# EAGLE design B7 OpenCR PCB Shield (EAGLE 9.6.2)
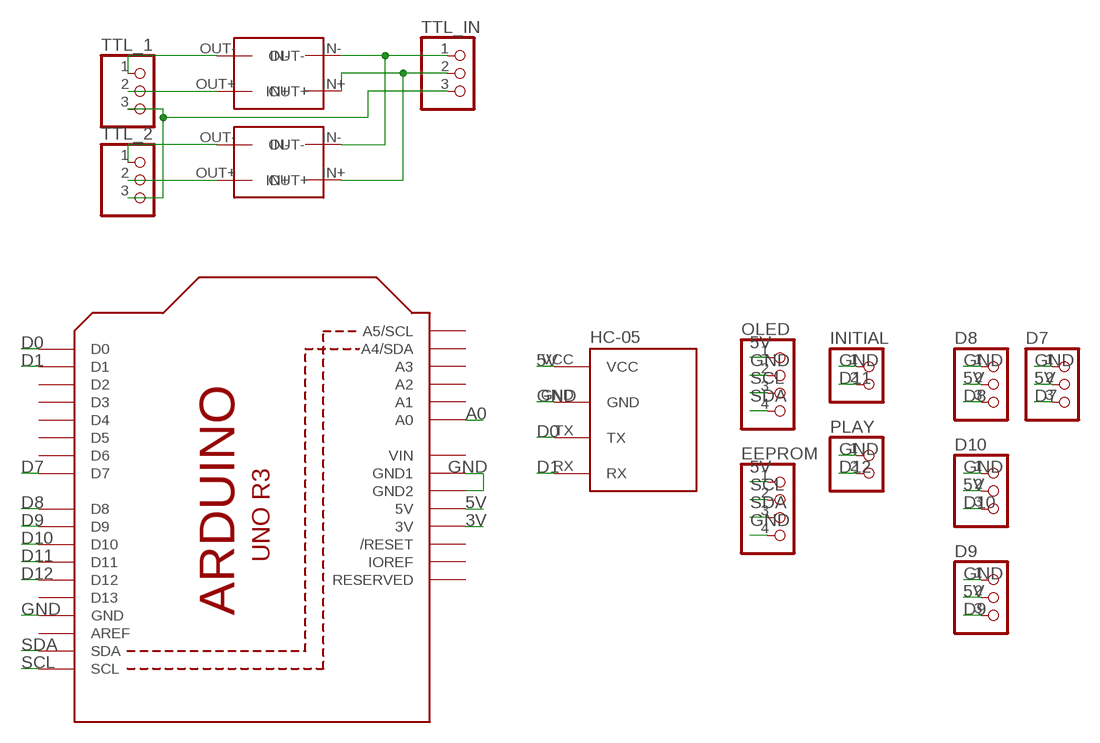
[diagram p0: schematic, sheet 1]

## Parts
D7  PINHD-1X3  [1X03]
D8  PINHD-1X3  [1X03]
D9  PINHD-1X3  [1X03]
D10  PINHD-1X3  [1X03]
EEPROM  PINHD-1X4  [1X04]
HC-05  BLUETOOTH_BOARD  [BT_BOARD_FOOTPRINT]
INITIAL  PINHD-1X2  [1X02]
OLED  PINHD-1X4  [1X04]
PLAY  PINHD-1X2  [1X02]
TTL_1  PINHD-1X3  [1X03]
TTL_2  PINHD-1X3  [1X03]
TTL_IN  PINHD-1X3  [1X03]
U2  ARDUINOR3-BPLACE  [ARDUINOR3-BPLACE]
U$1  LM2596LM2596  [LM2596]
U$2  LM2596LM2596  [LM2596]

## Nets
3V: U2.3V
5V: D7.2 D8.2 D9.2 D10.2 EEPROM.1 HC-05.VCC OLED.1 U2.5V
A0: U2.A0
D0: HC-05.TX U2.D0
D1: HC-05.RX U2.D1
D7: D7.3 U2.D7
D8: D8.3 U2.D8
D9: D9.3 U2.D9
D10: D10.3 U2.D10
D11: INITIAL.2 U2.D11
D12: PLAY.2 U2.D12
GND: D7.1 D8.1 D9.1 D10.1 EEPROM.4 HC-05.GND INITIAL.1 OLED.2 PLAY.1 U2.GND U2.GND1 U2.GND2
N$1: TTL_IN.1 U$1.IN- U$2.IN-
N$2: TTL_IN.2 U$1.IN+ U$2.IN+
N$3: TTL_1.3 TTL_2.3 TTL_IN.3
N$4: TTL_1.2 U$1.OUT+
N$5: TTL_2.2 U$2.OUT+
N$6: TTL_1.1 U$1.OUT-
N$9: TTL_2.1 U$2.OUT-
SCL: EEPROM.2 OLED.3 U2.SCL
SDA: EEPROM.3 OLED.4 U2.SDA
Unconnected: U2.A1 U2.A2 U2.A3 U2.A4(A4/SDA) U2.A5(A5/SCL) U2.AREF U2.D2 U2.D3 U2.D4 U2.D5 U2.D6 U2.D13 U2.IOREF U2.RESERVED U2.RESET(/RESET)

## Power pins joined to a net without a drawn wire
VIN: U2.VIN

## Library data of the parts
D7-D10 TTL_1 TTL_2 TTL_IN = pinhead:PINHD-1X3: PIN HEADER
EEPROM OLED = pinhead:PINHD-1X4: PIN HEADER
HC-05 = Bluetooth HC-05:BLUETOOTH_BOARD: Bluetooth Board V1.05
INITIAL PLAY = pinhead:PINHD-1X2: PIN HEADER
U2 = adafruit:ARDUINOR3: This is a new object for the new Arduino R3 - with extra pins that you may want to use (such as IOref, and duplicated A4/A5
U$1 U$2 = LM2596:LM2596

## Board
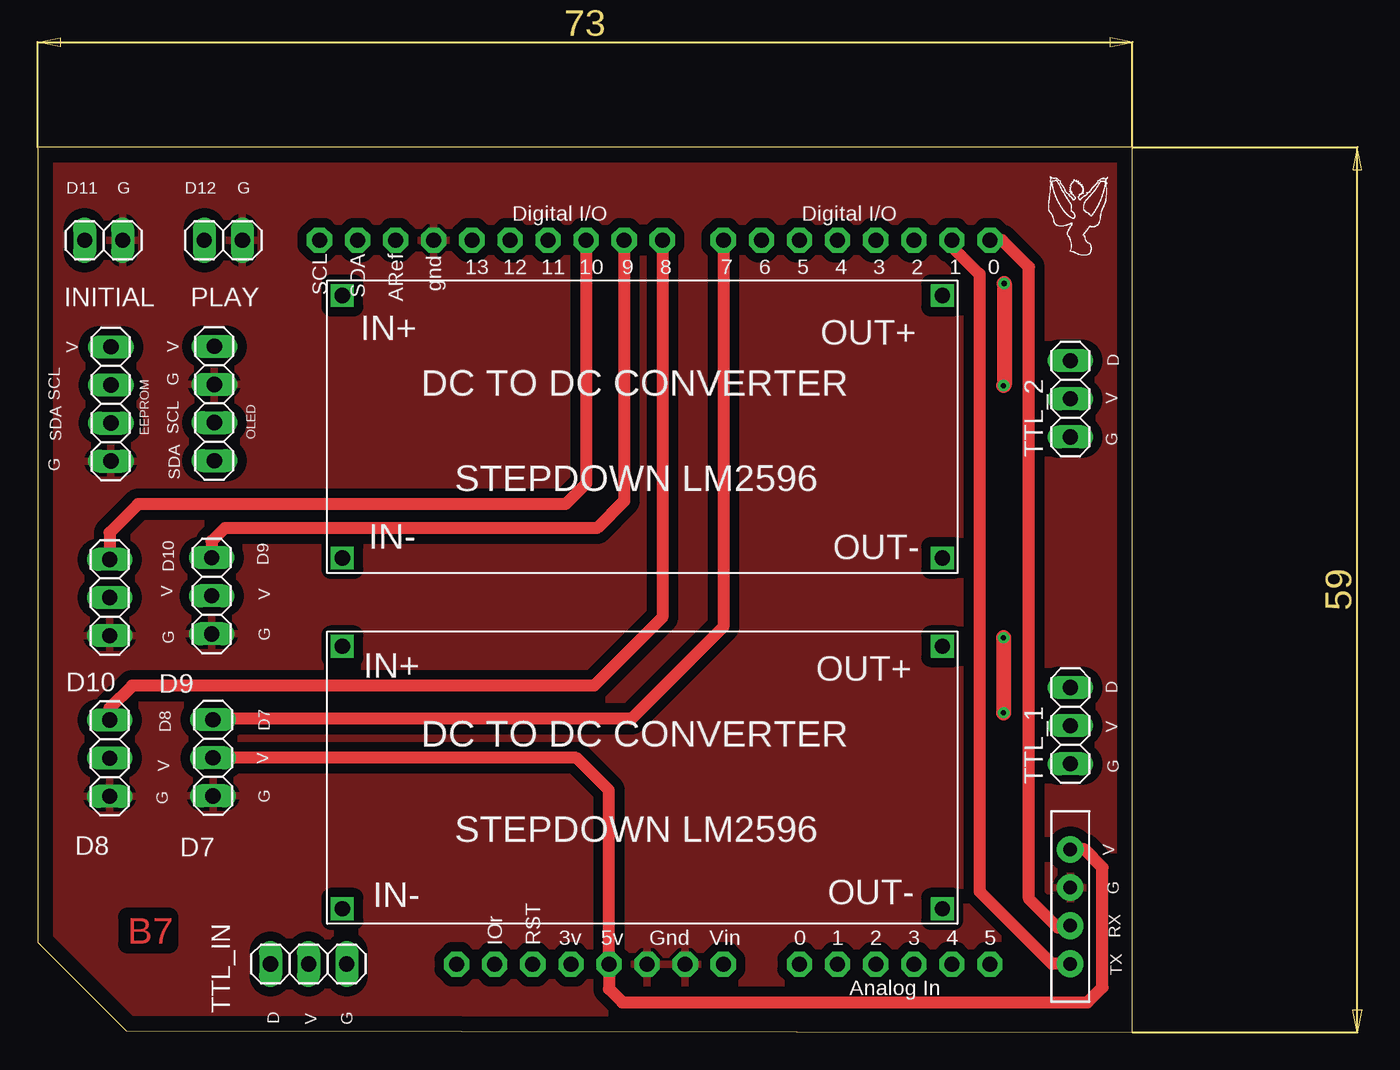
[diagram p1: board, top side]
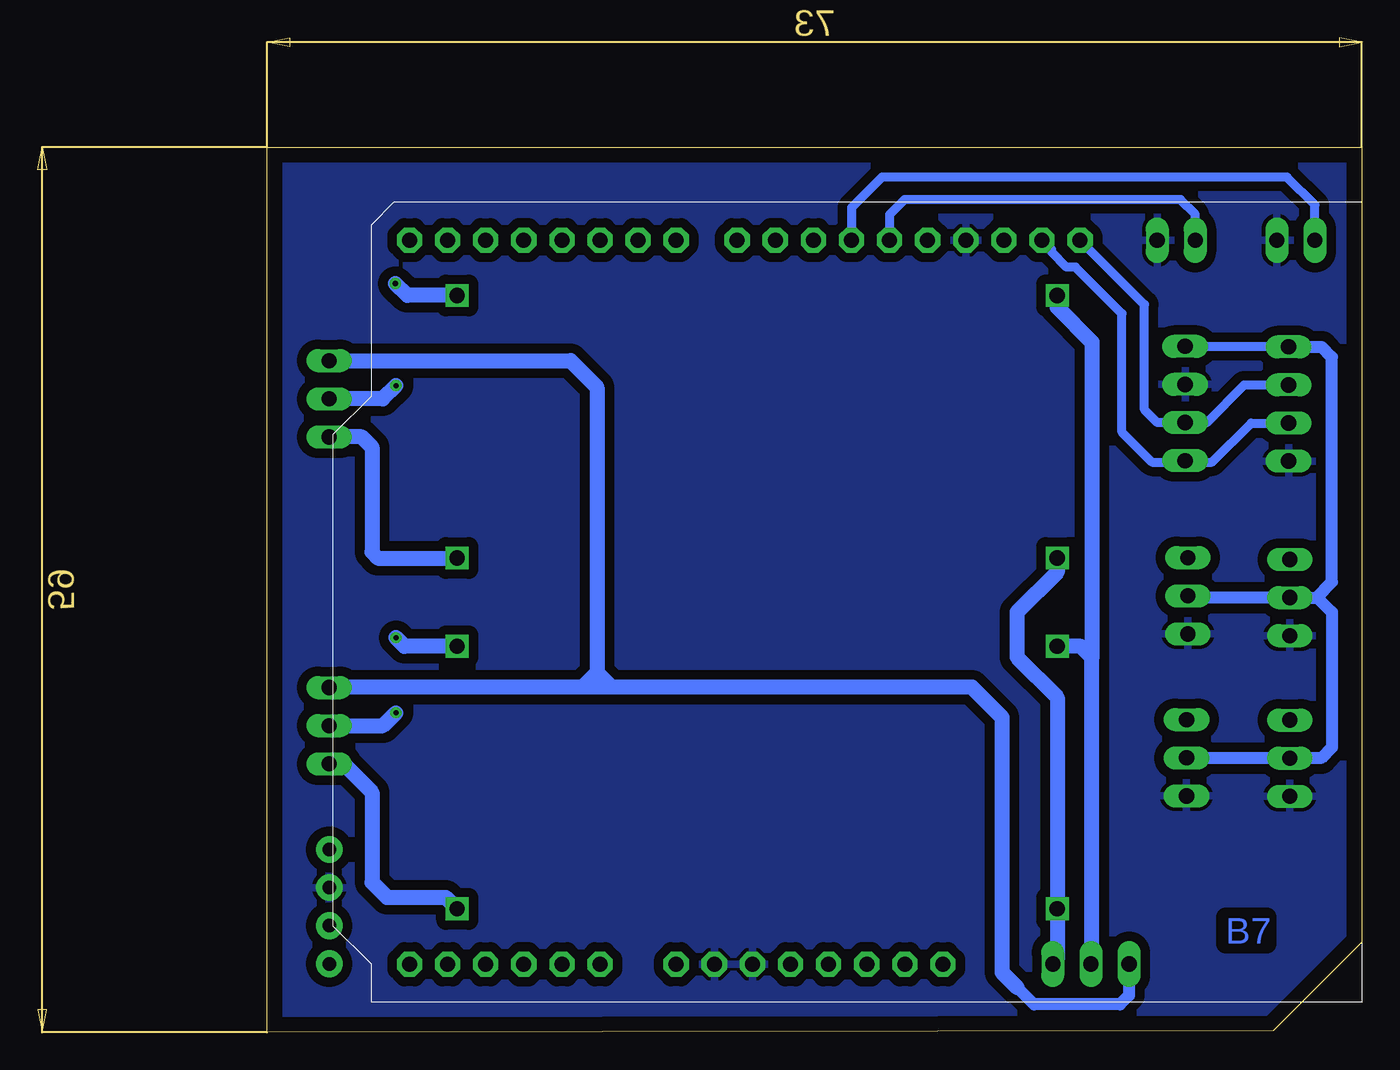
[diagram p2: board, bottom side, seen from below]

Size 73 x 59 mm. Coordinates in mm from the lower left corner, seen from the top.
Outline: 0,59 0,6 5.91,0.09 73,0 73,59 0,59
Copper layers (1*16): Top 0.035mm / dielectric 1.5mm / Bottom 0.035mm
Design rules "default *": minimum track width 6mil, minimum drill 0.35mm, track to track 25mil, track to pad 25mil, pad to pad 25mil, via to via 25mil, smd to smd 25mil, copper to edge 40mil, drill to drill 6mil, minimum pad ring 10mil, minimum via ring 8mil, stop-mask expansion 4mil, vias tented up to drill 0mil, thermal gap 10mil

### Footprints (pad centres in the part's own frame; a part is rotated, then mirrored left to right if it is on the bottom)
1X03 = drill 1.016 long: 1 -2.54,0; 2 0,0; 3 2.54,0
1X04 = drill 1.016 long: 1 -3.81,0; 2 -1.27,0; 3 1.27,0; 4 3.81,0
BT_BOARD_FOOTPRINT = drill 0.9 pad 1.778: GND 0,-1.27; RX 0,3.81; TX 0,1.27; VCC 0,-3.81
1X02 = drill 1.016 long: 1 -1.27,0; 2 1.27,0
ARDUINOR3-BPLACE = drill 1 pad 1.676 octagon: 3V 35.56,2.54; 5V 38.1,2.54; A0 50.8,2.54; A1 53.34,2.54; A2 55.88,2.54; A3 58.42,2.54; A4 60.96,2.54; A5 63.5,2.54; AREF 23.876,50.8; D0 63.5,50.8; D1 60.96,50.8; D2 58.42,50.8; D3 55.88,50.8; D4 53.34,50.8; D5 50.8,50.8; D6 48.26,50.8; D7 45.72,50.8; D8 41.656,50.8; D9 39.116,50.8; D10 36.576,50.8; D11 34.036,50.8; D12 31.496,50.8; D13 28.956,50.8; GND 26.416,50.8; GND1 43.18,2.54; GND2 40.64,2.54; IOREF 30.48,2.54; RESERVED 27.94,2.54; RESET 33.02,2.54; SCL 18.796,50.8; SDA 21.336,50.8; VIN 45.72,2.54
LM2596 = drill 1.016 square: IN+ 19,-8.5; IN- 19,9; OUT+ -21,-8.5; OUT- -21,9

### Placement (x,y rotation side)
D7  11.7,18.3 90 top
D8  4.81,18.27 90 top
D9  11.61,29.09 90 top
D10  4.81,28.98 90 top
EEPROM  4.89,41.88 270 top
HC-05  68.85,8.38 180 top
INITIAL  4.41,52.79 180 top
OLED  11.79,41.91 270 top
PLAY  12.39,52.79 180 top
TTL_1  68.86,20.44 90 top
TTL_2  68.86,42.22 90 top
TTL_IN  18.07,4.56 180 top
U2  0,2 0 top
U$1  39.32,17.23 180 top
U$2  39.32,40.61 180 top

### Tracks (layer width: path | path; a pad name or v marks a point on that pad's centre or on a via)
5V
  Top 0.813: HC-05.VCC 69.81,12.19 71,11 71,3 70,2 39,2 38.1,2.9 U2.5V 38.1,16.13 35.93,18.3 D7.2
  Bottom 0.61: OLED.1 4.92,45.72 EEPROM.1
  Bottom 0.813: D10.2 3.02,28.98 2,30 2,45 2.69,45.69 EEPROM.1 | D10.2 2.98,28.98 2,28 2,19 2.73,18.27 D8.2 11.67,18.27 D7.2 | D10.2 11.5,28.98 D9.2
D0
  Top 0.813: HC-05.TX 68.74,7 68,7 66.1,8.9 66.1,51 64.3,52.8 U2.D0
D1
  Top 0.813: HC-05.RX 67.63,4.57 62.8,9.4 62.8,50.52 61,52.32 61,52.76 U2.D1
D7
  Top 0.813: U2.D7 45.72,27.02 39.6,20.9 11.76,20.9 D7.3
D8
  Top 0.813: U2.D8 41.66,27.66 37.11,23.11 6.3,23.11 4.81,21.62 D8.3
D9
  Top 0.813: U2.D9 39.12,35.42 37.3,33.6 12.48,33.6 11.61,32.73 D9.3
D10
  Top 0.813: U2.D10 36.58,36.58 35.2,35.2 6.7,35.2 4.81,33.31 D10.3
D11
  Bottom 0.61: INITIAL.2 3.14,55.14 5,57 32,57 34.04,54.96 U2.D11
D12
  Bottom 0.61: PLAY.2 11.12,54.52 12.1,55.5 30.5,55.5 31.5,54.5 U2.D12
GND
  pour Top: 0,59 73,59 73,0 6,0 0,6
  pour Bottom: 0,59 73,59 73,0 6,0 0,6
N$1
  Bottom 1.016: U$2.IN- 20.32,30.68 23,28 23,25 20.32,22.32 U$1.IN- 20.32,4.85 TTL_IN.1
N$2
  Bottom 1.016: TTL_IN.2 18,4.63 18,25 | 18,25 18.73,25.73 U$1.IN+ | U$2.IN+ 20.32,48.32 18,46 18,25
N$3
  Bottom 0.813: TTL_IN.3 15.53,2.47 16.13,1.87 21.87,1.87 23,3
  Bottom 1.016: TTL_2.3 52.76,44.76 51,43 51,23.98 | 50.02,23 26,23 24,21 24,4 23,3 | 50.02,23 51.98,23 | 51.98,23 68.84,23 TTL_1.3 | 51,23.98 51.98,23 | 51,23.98 50.02,23
N$4  (via drill 0.35)
  Top 1.016: v64.4,26.3 v64.4,21.3
  Bottom 1.016: U$1.OUT+ 63.83,25.73 v64.4,26.3 | v64.4,21.3 65.26,20.44 TTL_1.2
N$5  (via drill 0.35)
  Top 1.016: v64.45,49.9 64.45,43.15 v64.4,43.1
  Bottom 1.016: U$2.OUT+ 63.66,49.11 v64.45,49.9 | v64.4,43.1 65.28,42.22 TTL_2.2
N$6
  Bottom 1.016: TTL_1.1 67.9,17.9 66,16 66,10 65,9 61.09,9 U$1.OUT-
N$9
  Bottom 1.016: TTL_2.1 66.68,39.68 66,39 66,32 65.61,31.61 U$2.OUT-
SCL
  Bottom 0.61: U2.SCL 14.5,48.5 14.5,41.5 13.64,40.64 OLED.3 10.36,40.64 7.85,43.15 EEPROM.2
SDA
  Bottom 0.61: EEPROM.3 7.39,40.61 10,38 11.69,38 OLED.4 11.89,38 14,38 16,40 16,47.9 19.11,51.01 19.7,51.01 20.7,52.01 20.7,52.16 U2.SDA

### Text on the board
Top: B7
Bottom: B7
tNames: D11 | G | D12 | G | IN+ | OUT+ | V | V | G | D | SCL | SCL | V | SDA | SDA | G | G | IN- | D10 | D9 | OUT- | V | V | G | G | IN+ | OUT+ | D10 | D9 | D | D8 | D7 | V | V | V | G | G | G | D8 | D7 | V | IN- | OUT- | G | RX | TX | D | V | G